# EAGLE design TA-1 (EAGLE 9.6.2)
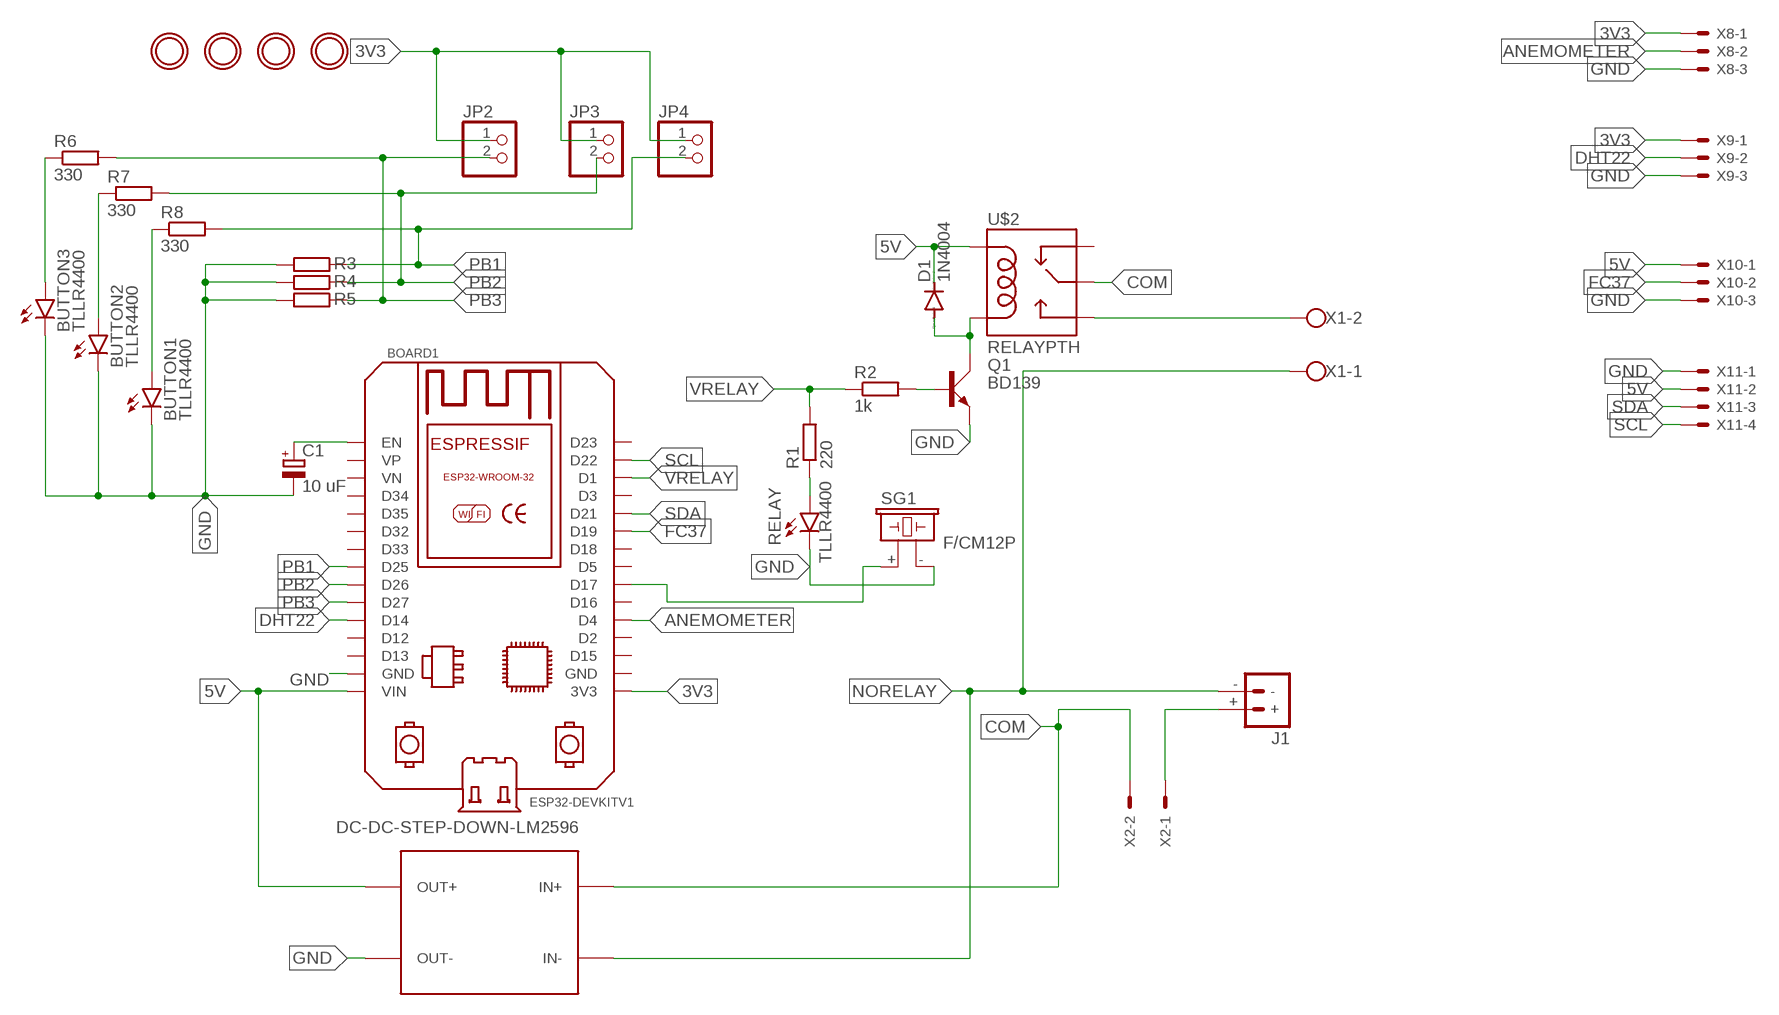
[diagram p0: schematic, sheet 1]

## Parts
BOARD1  ESP32DEVKITV1  [ESP32-DEVKITV1]
BUTTON1  TLLR4400  [LED3MM]
BUTTON2  TLLR4400  [LED3MM]
BUTTON3  TLLR4400  [LED3MM]
C1  10 uF  CPOL-EUE2.5-5  [E2,5-5]
D1  1N4004  [DO41-10]
J1  BATTERY_CONN_DEANS  [DEANS]
JP2  PINHD-1X2  [1X02]
JP3  PINHD-1X2  [1X02]
JP4  PINHD-1X2  [1X02]
Q1  BD139  [TO126AV]
R1  220  R-EU_0207/10  [0207/10]
R2  1k  R-EU_0207/10  [0207/10]
R3  R-EU_0207/10  [0207/10]
R4  R-EU_0207/10  [0207/10]
R5  R-EU_0207/10  [0207/10]
R6  330  R-EU_0207/10  [0207/10]
R7  330  R-EU_0207/10  [0207/10]
R8  330  R-EU_0207/10  [0207/10]
RELAY  TLLR4400  [LED3MM]
SG1  F/CM12P  [F/CM12P]
U$1  MICROBUILDER_MOUNTINGHOLE3.0THIN  [MICROBUILDER_MOUNTINGHOLE_3.0_PLATEDTHIN]
U$2  RELAYPTH  [SRD-05VDC-SL-C]
U$3  DC-DC-STEP-DOWN-LM2596  [DC-DC-STEP-DOWN-LM2596]
U$4  MICROBUILDER_MOUNTINGHOLE3.0THIN  [MICROBUILDER_MOUNTINGHOLE_3.0_PLATEDTHIN]
U$5  MICROBUILDER_MOUNTINGHOLE3.0THIN  [MICROBUILDER_MOUNTINGHOLE_3.0_PLATEDTHIN]
U$6  MICROBUILDER_MOUNTINGHOLE3.0THIN  [MICROBUILDER_MOUNTINGHOLE_3.0_PLATEDTHIN]
X1  W237-102  [W237-102]
X2  KK-156-2  [KK-156-2]
X8  KK-156-3  [KK-156-3]
X9  KK-156-3  [KK-156-3]
X10  KK-156-3  [KK-156-3]
X11  KK-156-4  [KK-156-4]

## Nets
3V3: BOARD1.3V3 JP2.1 JP3.1 JP4.1 X8.1 X9.1
5V: BOARD1.VIN D1.C U$2.COIL1 U$3.OUT+ X10.1 X11.2
ANEMOMETER: BOARD1.D4 X8.2
COM: U$2.SWCOMMON U$3.IN+ X2.2
DHT22: BOARD1.D14 X9.2
FC37: BOARD1.D19 X10.2
GND: BOARD1.GND BUTTON1.K(C) BUTTON2.K(C) BUTTON3.K(C) C1.- Q1.E R3.2 R4.2 R5.2 RELAY.K(C) SG1.- U$3.OUT- X8.3 X9.3 X10.3 X11.1
N$1: U$2.SWOPEN X1.2
N$2: J1.+ X2.1
N$3: R1.1 RELAY.A
N$6: BOARD1.EN C1.+
N$7: BUTTON3.A R6.1
N$8: BUTTON2.A R7.1
N$9: BUTTON1.A R8.1
N$11: BOARD1.D17 SG1.+
N$12: Q1.B R2.2
N$13: D1.A Q1.C U$2.COIL0
NORELAY: J1.- U$3.IN- X1.1
PB1: BOARD1.D25 JP4.2 R3.1 R8.2
PB2: BOARD1.D26 JP3.2 R4.1 R7.2
PB3: BOARD1.D27 JP2.2 R5.1 R6.2
SCL: BOARD1.D22 X11.4
SDA: BOARD1.D21 X11.3
VRELAY: BOARD1.D1 R1.2 R2.1
Unconnected: BOARD1.D2 BOARD1.D3 BOARD1.D5 BOARD1.D12 BOARD1.D13 BOARD1.D15 BOARD1.D16 BOARD1.D18 BOARD1.D23 BOARD1.D32 BOARD1.D33 BOARD1.D34 BOARD1.D35 BOARD1.GND@1(GND) BOARD1.VN BOARD1.VP U$2.SWCLOSED(SWCLOSE)

## Library data of the parts
BOARD1 = ESP32-DEVKITV1:ESP32DEVKITV1: https://github.com/shridattdudhat
BUTTON1-BUTTON3 RELAY = led:TLLR4400: Low Current (2mA) LED 3 mm Tinted Diffused Package color RED Source: Data sheet <http://www.farnell.com/datasheets/391100.pdf>; MF: VISHAY SEMICONDUCTOR; OC_FARNELL: 1612437
C1 = rcl:CPOL-EU: POLARIZED CAPACITOR, European symbol; SPICEPREFIX: C
D1 = diode:1N4004: DIODE general purpose rectifier, 1 A
J1 = SparkFun-Connectors:BATTERY_CONN: Battery Connectors Various footprints for battery connections SparkFun Products: Deans Connector -M/F Pair <https://www.sparkfun.com/products/11864>; SF_ID: PRT-11864
JP2-JP4 = pinhead:PINHD-1X2: PIN HEADER
Q1 = transistor-power:BD139: NPN TRANSISTOR
R1-R8 = rcl:R-EU_: RESISTOR, European symbol; SPICEPREFIX: R
SG1 = buzzer:F/CM12P: BUZZER Source: Buerklin; OC_FARNELL: unknown; OC_NEWARK: unknown
U$1 U$4-U$6 = Adafruit_MCP9808_Breakout:MICROBUILDER_MOUNTINGHOLE: Mounting Hole For #2 screws (0.086"/2.18mm width, 0.094"/2.4mm hole) use 2.5mm
U$2 = SRD-05VDC-SL-C:RELAY: SPDT relay (COM-00101)
U$3 = 0.96inch OLED:DC-DC-STEP-DOWN-LM2596: DC/DC Step-Down Regulator based on LM2596-ADJ chip LM2596 datasheet available here: http://www.ti.com/lit/ds/symlink/lm2596.pdf Click here to find device on ebay.com <http://www.ebay.com/sch/lm2596+power+regulator>
X1 = con-wago-500:W237-102: WAGO SCREW CLAMP; MPN: 237-102; OC_FARNELL: unknown; OC_NEWARK: 70K9898
X2 = con-molex:KK-156-2: KK 156 HEADER Source: http://www.molex.com/pdm_docs/sd/026604100_sd.pdf; OC_FARNELL: unknown; OC_NEWARK: unknown
X8-X10 = con-molex:KK-156-3: KK 156 HEADER Source: http://www.molex.com/pdm_docs/sd/026604100_sd.pdf; MF: MOLEX; OC_FARNELL: unknown; OC_NEWARK: unknown
X11 = con-molex:KK-156-4: KK 156 HEADER Source: http://www.molex.com/pdm_docs/sd/026604100_sd.pdf; MF: MOLEX; OC_FARNELL: unknown; OC_NEWARK: unknown

## Board
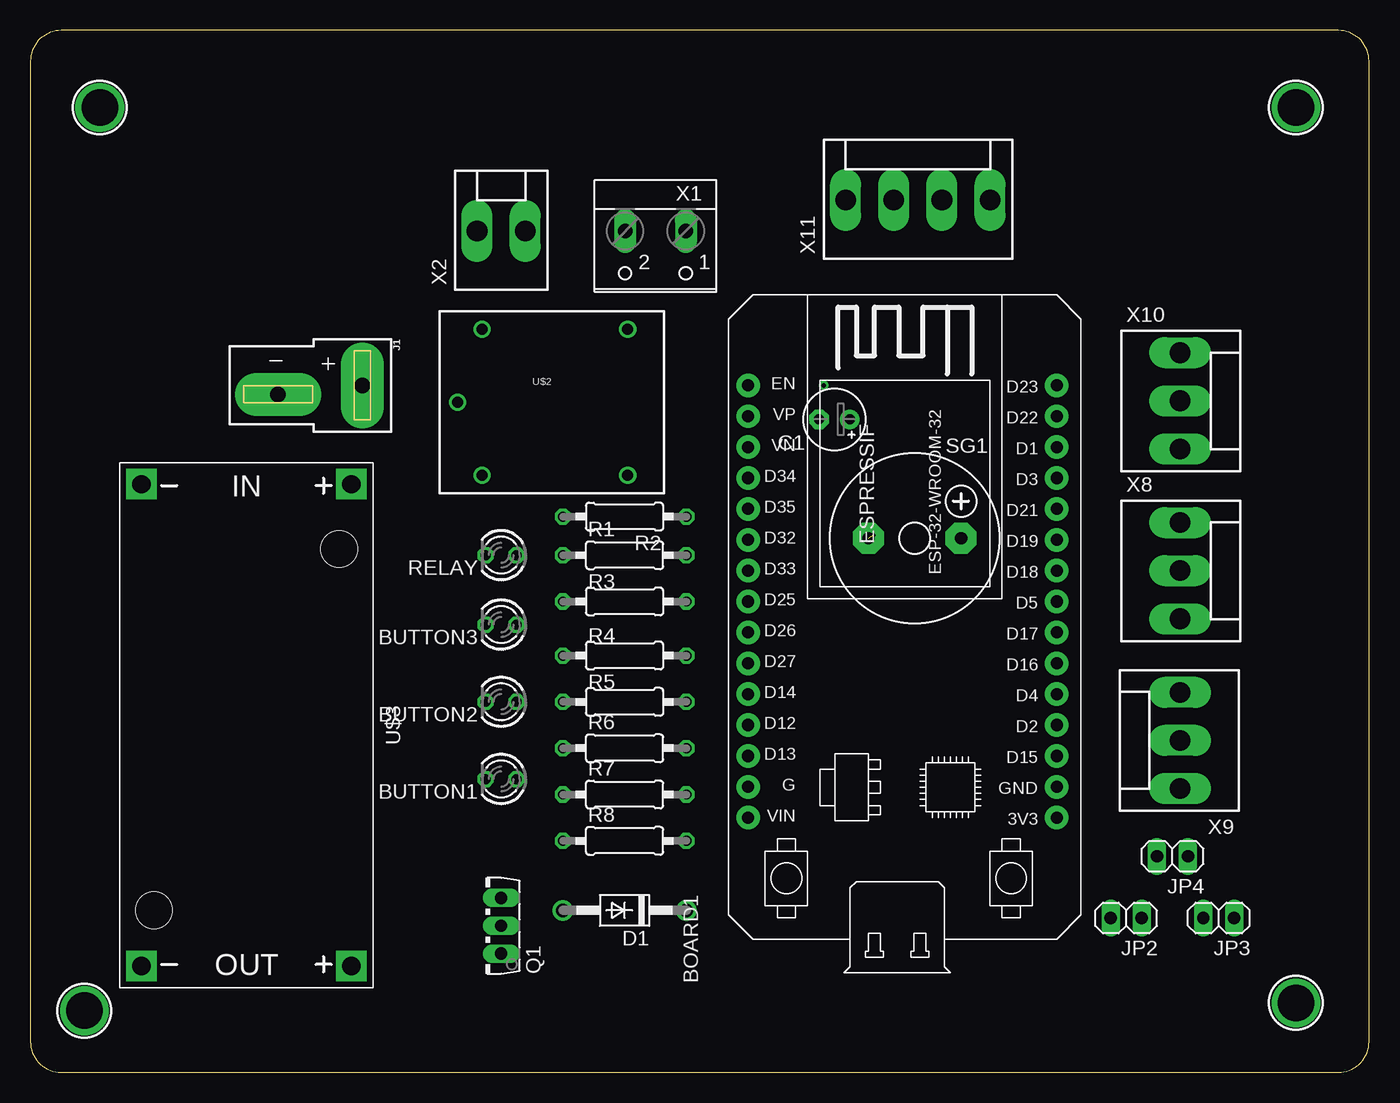
[diagram p1: board, top side]
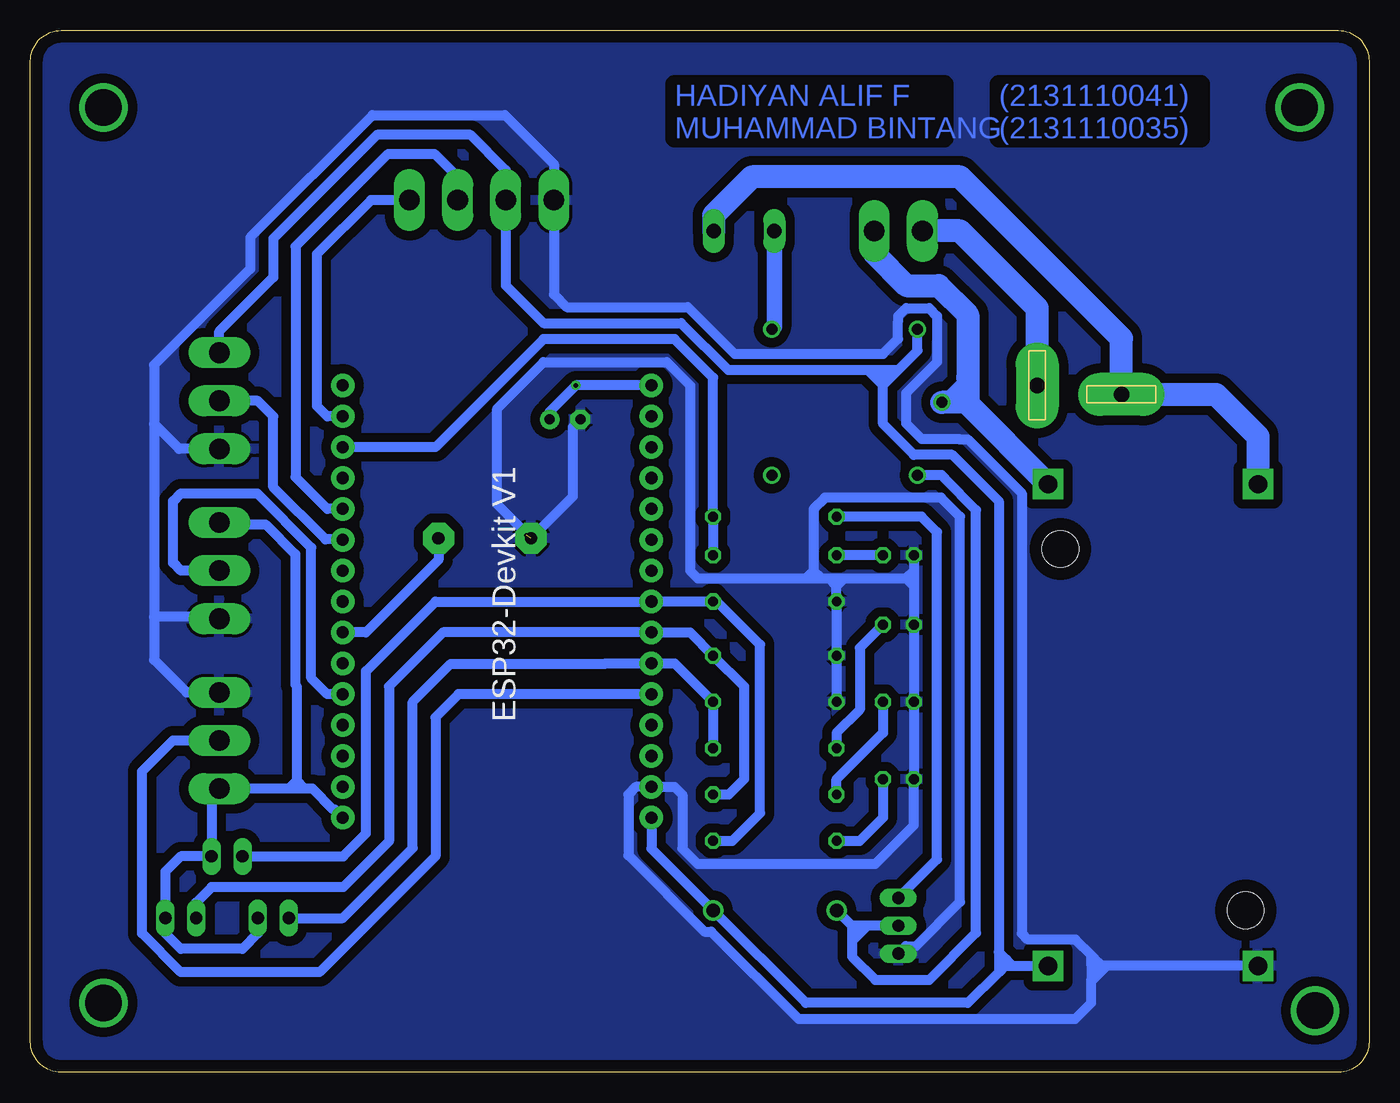
[diagram p2: board, bottom side, seen from below]

Size 110.16 x 85.72 mm. Coordinates in mm from the lower left corner, seen from the top.
Outline: 0,83.17 0,2.54 arc90 2.54,0 107.62,0 arc90 110.16,2.54 110.16,83.17 arc90 107.62,85.72 2.54,85.72 arc90 0,83.17
Copper layers (1*16): Top 0.035mm / dielectric 1.5mm / Bottom 0.035mm
Design rules "default *": minimum track width 6mil, minimum drill 0.35mm, track to track 0.5mm, track to pad 0.5mm, pad to pad 0.5mm, via to via 0.5mm, smd to smd 0.5mm, copper to edge 40mil, drill to drill 6mil, minimum pad ring 10mil, minimum via ring 8mil, stop-mask expansion 4mil, vias tented up to drill 0mil, thermal gap 10mil

### Footprints (pad centres in the part's own frame; a part is rotated, then mirrored left to right if it is on the bottom)
ESP32-DEVKITV1 = drill 1 pad 1.93: 3V3 0,0; D1 30.48,0; D2 7.62,0; D3 27.94,0; D4 10.16,0; D5 17.78,0; D12 7.62,25.4; D13 5.08,25.4; D14 10.16,25.4; D15 5.08,0; D16 12.7,0; D17 15.24,0; D18 20.32,0; D19 22.86,0; D21 25.4,0; D22 33.02,0; D23 35.56,0; D25 17.78,25.4; D26 15.24,25.4; D27 12.7,25.4; D32 22.86,25.4; D33 20.32,25.4; D34 27.94,25.4; D35 25.4,25.4; EN 35.56,25.4; GND 2.54,25.4; GND@1 2.54,0; VIN 0,25.4; VN 30.48,25.4; VP 33.02,25.4
LED3MM = drill 0.813 octagon: A -1.27,0; K 1.27,0
E2,5-5 = drill 0.813 pad 1.6: + -1.27,0 | drill 0.813 pad 1.6 octagon: - 1.27,0
DO41-10 = drill 1.118: A 5.08,0; C -5.08,0
DEANS = drill 1.27 pad 3.556 long: + 0,0; - 0.737,-6.921
1X02 = drill 1.016 long: 1 -1.27,0; 2 1.27,0
TO126AV = drill 1.016 long: B 2.286,-1.27; C 0,-1.27; E -2.286,-1.27
0207/10 = drill 0.813 octagon: 1 -5.08,0; 2 5.08,0
F/CM12P = drill 1.016 pad 2.54 octagon: + 3.81,0; - -3.81,0
MICROBUILDER_MOUNTINGHOLE_3.0_PLATEDTHIN = drill 3 pad 3.6: P$1 0,0
SRD-05VDC-SL-C = drill 0.9: COIL0 -5.39,-6.12; COIL1 -5.39,5.88; SWCLOSED 6.61,-6.12; SWCOMMON -7.39,-0.12; SWOPEN 6.61,5.88
DC-DC-STEP-DOWN-LM2596 = drill 1.5 pad 2.5 square: IN+ -19.812,8.636; IN- -19.812,-8.636; OUT+ 19.812,8.636; OUT- 19.812,-8.636 | hole 3: -14.478,7.62; 15.24,-7.62
W237-102 = drill 1.194 long: 1 -2.5,-1.27; 2 2.5,-1.27
KK-156-2 = drill 1.7 pad 2.184 long: 1 -1.98,0; 2 1.98,0
KK-156-3 = drill 1.7 pad 2.184 long: 1 -3.96,0; 2 0,0; 3 3.96,0
KK-156-4 = drill 1.7 pad 2.184 long: 1 -5.94,0; 2 -1.98,0; 3 1.98,0; 4 5.94,0

### Placement (x,y rotation side)
BOARD1  84.45,20.96 90 top
BUTTON1  38.73,24.13 180 top
BUTTON2  38.73,30.48 180 top
BUTTON3  38.73,36.83 180 top
C1  66.17,53.72 180 top
D1  48.89,13.33 180 top
J1  27.3,56.52 270 top
JP2  90.17,12.7 180 top
JP3  97.79,12.7 180 top
JP4  93.98,17.78 180 top
Q1  37.46,12.06 90 top
R1  48.89,42.55 0 top
R2  48.89,45.72 180 top
R3  48.89,38.73 180 top
R4  48.89,34.29 180 top
R5  48.89,30.48 180 top
R6  48.89,26.67 0 top
R7  48.89,22.86 0 top
R8  48.89,19.05 0 top
RELAY  38.73,42.55 180 top
SG1  72.77,43.94 0 top
U$1  4.45,5.08 0 top
U$2  42.55,55.25 0 top
U$3  17.78,28.58 270 top
U$4  104.14,5.71 0 top
U$5  5.72,79.38 0 top
U$6  104.14,79.38 0 top
X1  51.43,67.95 180 top
X2  38.73,69.22 0 top
X8  94.61,41.27 270 top
X9  94.61,27.3 90 top
X10  94.61,55.25 270 top
X11  73.02,71.75 0 top

### Tracks (layer width: path | path; a pad name or v marks a point on that pad's centre or on a via)
3V3
  Bottom 0.813: BOARD1.3V3 85.12,21.62 85.23,21.62 86.95,23.35 87.63,23.35 | 88.27,23.35 88.9,23.35 | 88.9,23.35 X9.1 95.25,22.71 JP4.1 97.79,17.78 99.06,16.51 JP3.1 99.06,11.43 97.79,10.16 92.71,10.16 91.44,11.43 JP2.1 | X8.1 94.47,45.09 90.81,45.09 88.36,42.63 88.36,31.89 88.27,31.8 88.27,23.98 | 88.27,23.98 88.27,23.35 | 88.9,23.35 88.27,23.98 | 87.63,23.35 88.27,23.98 | 87.63,23.35 88.27,23.35
5V
  Bottom 0.813: X10.1 94.61,60.96 90.17,65.41 90.17,68.58 81.63,77.12 73.94,77.12 71.05,74.22 X11.2 71.05,64.74 67.94,61.64 56.61,61.64 52.75,57.79 41.27,57.79 | 41.27,57.79 40,57.79 | 40,57.79 38.73,57.79 | 38.73,57.79 37.16,59.37 U$2.COIL1 | BOARD1.VIN 59.05,18.42 D1.C 46.35,5.71 33.02,5.71 30.48,8.25 | 29.97,8.76 29.34,8.76 | 29.34,8.76 U$3.OUT+ | 30.48,8.25 29.97,8.76 | 29.34,8.76 29.84,9.27 | 29.84,9.27 30.48,9.91 | 30.48,9.91 30.48,46.99 34.29,50.8 37.46,50.8 40,53.34 40,56.52 | 29.97,8.76 29.84,8.89 29.84,9.27 | 30.48,9.91 30.48,8.25 | 40,56.52 40,57.79 | 38.73,57.79 40,56.52 | 40,56.52 41.27,57.79
ANEMOMETER
  Bottom 0.813: X8.2 97.79,41.27 98.42,41.91 98.42,46.99 97.79,47.62 91.5,47.62 87.04,43.17 87.04,32.43 85.72,31.12 BOARD1.D4
COM
  Bottom 0.813: U$2.SWCOMMON 33.13,57.15 33.02,57.15
  Bottom 1.27: 27.3,49.28 U$3.IN+
  Bottom 1.905: X2.2 40.71,67.39 38.05,64.72 35.42,64.72 33.02,62.32 33.02,57.15 33.02,55.25 33.14,55.12 | 33.14,55.12 U$2.SWCOMMON | U$3.IN+ 33.14,55.11 33.14,55.12
DHT22
  Bottom 0.813: X9.2 98.42,27.3 100.97,24.77 100.97,11.43 97.79,8.25 86.36,8.25 76.83,17.78 76.83,29.21 74.93,31.12 BOARD1.D14
FC37
  Bottom 0.813: BOARD1.D19 84.49,43.85 85.86,43.85 90.17,48.15 90.17,53.98 91.44,55.25 X10.2
GND  (via drill 0.35)  (1 unrouted)
  Bottom 0.813: R5.2 R4.2 R3.2 43.81,40.01 | Q1.E 38.12,10.4 37.28,10.4 33.66,14.02 33.66,45.72 35.22,47.29 44.79,47.29 45.72,46.36 45.72,41.27 | 45.72,41.27 45.72,40.64 | RELAY.K 37.46,41.27 | 37.46,41.27 37.46,40.64 | 37.46,40.64 37.46,40.01 | 37.46,40.01 BUTTON3.K BUTTON2.K BUTTON1.K 37.46,20.32 40.64,17.14 55.25,17.14 56.52,18.42 56.52,22.86 57.15,23.5 BOARD1.GND 60.33,23.5 60.96,22.86 60.96,17.85 54.7,11.59 54.14,11.59 46.95,4.4 24.17,4.4 22.86,5.71 22.86,7.62 | 99.98,53.34 99.98,37.47 | 99.98,37.47 99.98,33.94 97.3,31.27 X9.3 | 99.98,53.34 99.98,58.2 92.08,66.11 92.08,68.68 82.02,78.74 71.12,78.74 67.08,74.7 X11.1 67.08,64 66.04,62.95 56.06,62.95 52.21,59.1 40,59.1 38.77,60.34 38.77,61.79 38.73,61.82 38.73,62.23 38.1,62.87 36.2,62.87 35.55,62.22 35.55,58.44 38.1,55.88 38.1,53.38 36.83,52.11 33.75,52.11 33.7,52.07 33.02,52.07 28.57,47.62 28.57,11.43 28.06,10.92 24.16,10.92 22.86,9.62 | X8.3 94.77,37.47 99.98,37.47 | X10.3 97.92,51.29 99.98,53.34 | C1.- 65.53,53.09 65.53,47.37 SG1.- 71.75,46.74 71.75,54.61 67.94,58.42 57.78,58.42 55.88,56.52 55.88,41.27 55.25,40.64 46.35,40.64 | 46.35,40.64 45.72,40.64 | 45.72,40.64 45.09,40.64 | 45.09,40.64 44.45,40.64 | 44.45,40.64 43.81,40.64 | 43.81,40.64 43.18,40.64 | 43.18,40.64 38.1,40.64 | 38.1,40.64 37.46,40.64 | 43.81,40.64 43.81,40.01 | 37.46,40.01 38.1,40.64 | 37.46,41.27 38.1,40.64 | 43.18,40.64 43.81,40.01 | 43.81,40.01 44.45,40.64 | 45.09,40.64 45.72,41.27 | 46.35,40.64 45.72,41.27 | 22.86,8.89 22.86,7.62 | 22.86,8.89 22.86,9.62 | U$3.OUT- 21.59,8.76 | 21.59,8.76 22.23,8.76 | 22.23,8.76 22.73,8.76 22.86,8.89 | 22.86,9.62 22.23,8.99 22.23,8.76
  Bottom 0.813: 22.86,7.62 22.73,7.62 21.59,8.76
  other vias: 69.34,44.2
  pour Bottom (isolate 0.762): 107.95,0 2.54,0 arc-90 0,2.54 0,83.19 arc-90 2.54,85.72 107.95,85.72 arc-90 110.49,83.19 110.49,2.54 arc-90
N$1
  Bottom 1.27: X1.2 48.93,61.34 U$2.SWOPEN
N$2
  Bottom 1.905: X2.1 33.66,69.22 27.3,62.87 J1.+
N$3
  Bottom 0.813: RELAY.A R1.1
N$6  (via drill 0.35)
  Bottom 0.813: BOARD1.EN v65.28,56.52 67.44,54.36 C1.+
N$7
  Bottom 0.813: BUTTON3.A 41.91,34.93 41.91,29.85 43.81,27.94 R6.1
N$8
  Bottom 0.813: R7.1 43.81,24.13 40,27.94 BUTTON2.A
N$9
  Bottom 0.813: BUTTON1.A 40,20.96 41.91,19.05 R8.1
N$11
  Bottom 0.813: SG1.+ 76.58,42.16 82.55,36.2 BOARD1.D17
N$12
  Bottom 0.813: Q1.B 35.56,17.53 35.56,44.45 36.83,45.72 R2.2
N$13
  Bottom 0.813: Q1.C 41.27,12.06 | 41.27,12.06 42.55,12.06 | D1.A 42.55,12.06 | 42.55,12.06 42.55,10.79 | 42.55,10.79 42.55,9.53 40.64,7.62 36.2,7.62 32.34,11.47 32.34,46.26 34.92,48.85 34.92,48.9 35.16,49.12 U$2.COIL0 | 42.55,10.79 41.27,12.06
NORELAY
  Bottom 1.905: U$3.IN- 9.14,52.32 12.6,55.78 J1.- 20.38,60.39 33.66,73.66 50.8,73.66 53.94,70.53 X1.1
PB1
  Bottom 0.813: R8.2 52.39,19.05 50.12,21.32 50.12,35.19 53.66,38.73 R3.1 BOARD1.D25 76.83,38.73 82.55,33.02 82.55,19.66 84.42,17.78 JP4.2
PB2
  Bottom 0.813: R7.2 52.7,22.86 51.43,24.13 51.43,31.75 R4.1 55.88,36.2 BOARD1.D26 76.2,36.2 80.64,31.75 80.64,19 84.41,15.24 95.25,15.24 96.52,13.97 JP3.2
PB3
  Bottom 0.813: R6.2 R5.1 57.15,33.66 BOARD1.D27 62.86,33.66 62.91,33.61 75.56,33.61 78.7,30.48 78.7,18.46 84.45,12.7 JP2.2
SCL
  Bottom 0.813: X11.4 82.14,71.75 86.58,67.31 86.58,54.84 85.72,53.98 BOARD1.D22
SDA
  Bottom 0.813: X11.3 75,73.66 76.91,75.56 80.72,75.56 88.34,67.95 88.34,48.97 85.72,46.36 BOARD1.D21
VRELAY
  Bottom 0.813: R1.2 R2.1 53.97,57.15 57.15,60.33 67.94,60.33 76.83,51.44 BOARD1.D1

### Text on the board
Bottom: (2131110041) / (2131110035) | HADIYAN ALIF F / MUHAMMAD BINTANG